# EAGLE schematic AnalogInputModule_r1_1 (EAGLE 8.4.3)
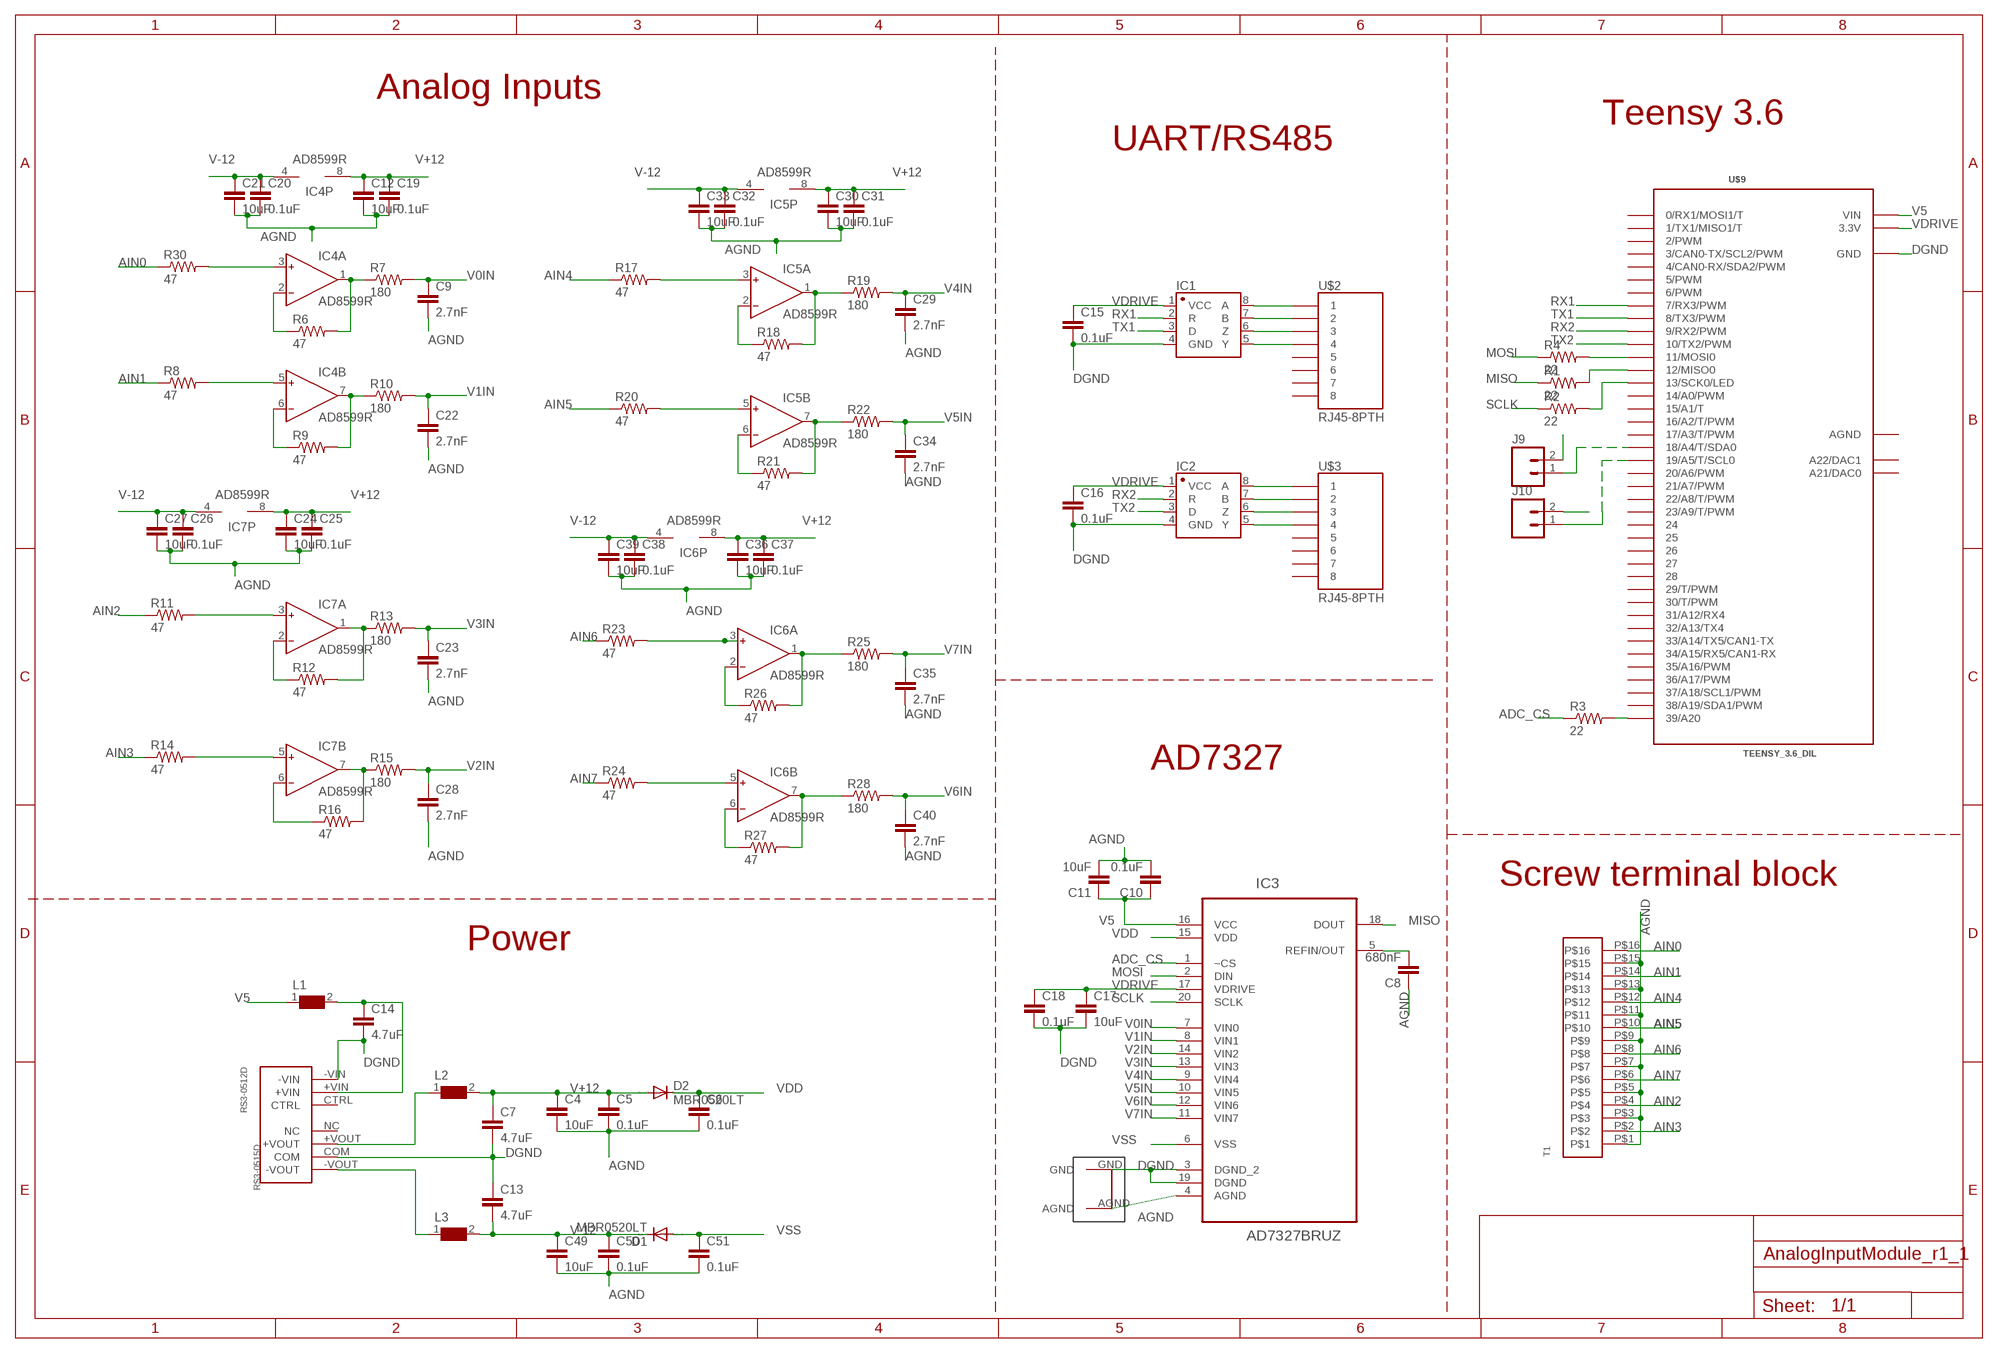
[diagram p0: schematic, sheet 1]

## Parts
C4  10uF  10UF-0805-10V-10%  [0805]
C5  0.1uF  1.0UF-0805-25V-10%  [0805]
C6  0.1uF  1.0UF-0805-25V-10%  [0805]
C7  4.7uF  4.7UF-1206-16V-(+80/-20%)  [1206]
C8  680nF  1.0UF-0805-25V-10%  [0805]
C9  2.7nF  1.0UF-0805-25V-10%  [0805]
C10  0.1uF  1.0UF-0805-25V-10%  [0805]
C11  10uF  10UF-0805-10V-10%  [0805]
C12  10uF  10UF-0805-10V-10%  [0805]
C13  4.7uF  4.7UF-1206-16V-(+80/-20%)  [1206]
C14  4.7uF  4.7UF-1206-16V-(+80/-20%)  [1206]
C15  0.1uF  1.0UF-0805-25V-10%  [0805]
C16  0.1uF  1.0UF-0805-25V-10%  [0805]
C17  10uF  10UF-0805-10V-10%  [0805]
C18  0.1uF  1.0UF-0805-25V-10%  [0805]
C19  0.1uF  1.0UF-0805-25V-10%  [0805]
C20  0.1uF  1.0UF-0805-25V-10%  [0805]
C21  10uF  10UF-0805-10V-10%  [0805]
C22  2.7nF  1.0UF-0805-25V-10%  [0805]
C23  2.7nF  1.0UF-0805-25V-10%  [0805]
C24  10uF  10UF-0805-10V-10%  [0805]
C25  0.1uF  1.0UF-0805-25V-10%  [0805]
C26  0.1uF  1.0UF-0805-25V-10%  [0805]
C27  10uF  10UF-0805-10V-10%  [0805]
C28  2.7nF  1.0UF-0805-25V-10%  [0805]
C29  2.7nF  1.0UF-0805-25V-10%  [0805]
C30  10uF  10UF-0805-10V-10%  [0805]
C31  0.1uF  1.0UF-0805-25V-10%  [0805]
C32  0.1uF  1.0UF-0805-25V-10%  [0805]
C33  10uF  10UF-0805-10V-10%  [0805]
C34  2.7nF  1.0UF-0805-25V-10%  [0805]
C35  2.7nF  1.0UF-0805-25V-10%  [0805]
C36  10uF  10UF-0805-10V-10%  [0805]
C37  0.1uF  1.0UF-0805-25V-10%  [0805]
C38  0.1uF  1.0UF-0805-25V-10%  [0805]
C39  10uF  10UF-0805-10V-10%  [0805]
C40  2.7nF  1.0UF-0805-25V-10%  [0805]
C49  10uF  10UF-0805-10V-10%  [0805]
C50  0.1uF  1.0UF-0805-25V-10%  [0805]
C51  0.1uF  1.0UF-0805-25V-10%  [0805]
D1  MBR0520LT  [SOD123]
D2  MBR0520LT  [SOD123]
IC1  SN65HVD31DR  [SO08]
IC2  SN65HVD31DR  [SO08]
IC3  AD7327BRUZ  [SOP65P640X120-20N]
IC4  AD8599R  [SO8]
IC5  AD8599R  [SO8]
IC6  AD8599R  [SO8]
IC7  AD8599R  [SO8]
J9  M023.5MM  [SCREWTERMINAL-3.5MM-2]
J10  M023.5MM  [SCREWTERMINAL-3.5MM-2]
L1  WE-CBF-742792118_1206  [1206]
L2  WE-CBF-742792118_1206  [1206]
L3  WE-CBF-742792118_1206  [1206]
R1  22  R-US_R0805  [R0805]
R2  22  R-US_R0805  [R0805]
R3  22  R-US_R0805  [R0805]
R4  22  R-US_R0805  [R0805]
R6  47  R-US_R0805  [R0805]
R7  180  R-US_R0805  [R0805]
R8  47  R-US_R0805  [R0805]
R9  47  R-US_R0805  [R0805]
R10  180  R-US_R0805  [R0805]
R11  47  R-US_R0805  [R0805]
R12  47  R-US_R0805  [R0805]
R13  180  R-US_R0805  [R0805]
R14  47  R-US_R0805  [R0805]
R15  180  R-US_R0805  [R0805]
R16  47  R-US_R0805  [R0805]
R17  47  R-US_R0805  [R0805]
R18  47  R-US_R0805  [R0805]
R19  180  R-US_R0805  [R0805]
R20  47  R-US_R0805  [R0805]
R21  47  R-US_R0805  [R0805]
R22  180  R-US_R0805  [R0805]
R23  47  R-US_R0805  [R0805]
R24  47  R-US_R0805  [R0805]
R25  180  R-US_R0805  [R0805]
R26  47  R-US_R0805  [R0805]
R27  47  R-US_R0805  [R0805]
R28  180  R-US_R0805  [R0805]
R30  47  R-US_R0805  [R0805]
RS3-0512D  RS3-0515D  [RS3-0515D]
T1  16POS_SCREWTERMINAL  [16POS_SCREWTERMINAL]
U$2  RJ45-8PTH  [RJ45-8]
U$3  RJ45-8PTH  [RJ45-8]
U$4  GNDPLANESHRT  [GNDPLANESHRT]
U$9  TEENSY_3.6_DIL  [TEENSY_3.6_DIL]

## Nets
+VOUT: L2.1 RS3-0512D.+VOUT
-VOUT: L3.1 RS3-0512D.-VOUT
ADC_CS: IC3.1(~CS) R3.1
AGND: C4.2 C5.2 C6.2 C8.1 C9.2 C10.2 C11.2 C12.2 C19.2 C20.2 C21.2 C22.2 C23.2 C24.2 C25.2 C26.2 C27.2 C28.2 C29.2 C30.2 C31.2 C32.2 C33.2 C34.2 C35.2 C36.2 C37.2 C38.2 C39.2 C40.2 C49.2 C50.2 C51.2 IC3.4(AGND) T1.P$1 T1.P$3 T1.P$5 T1.P$7 T1.P$9 T1.P$11 T1.P$13 T1.P$15 U$4.AGND
AIN0: R30.1 T1.P$16
AIN1: R8.1 T1.P$14
AIN2: R11.1 T1.P$4
AIN3: R14.1 T1.P$2
AIN4: R17.1 T1.P$12
AIN5: R20.1 T1.P$10
AIN6: R23.1 T1.P$8
AIN7: R24.1 T1.P$6
DGND: C7.2 C13.1 C14.2 C15.2 C16.2 C17.2 C18.2 IC1.4(GND) IC2.4(GND) IC3.3(DGND_2) IC3.19(DGND) J9.2 J10.2 RS3-0512D.-VIN RS3-0512D.COM U$4.GND U$9.GND U$9.GND1(GND)
MISO: IC3.18(DOUT) R1.1
MOSI: IC3.2(DIN) R4.1
N$1: IC1.6(Z) U$2.3
N$3: IC1.8(A) U$2.1
N$4: IC1.5(Y) U$2.4
N$5: IC1.7(B) U$2.2
N$6: IC2.6(Z) U$3.3
N$7: IC2.5(Y) U$3.4
N$8: IC2.8(A) U$3.1
N$9: IC2.7(B) U$3.2
N$10: R4.2 U$9.11(11/MOSI0)
N$11: R1.2 U$9.12(12/MISO0)
N$12: C14.1 L1.2 RS3-0512D.+VIN
N$13: R3.2 U$9.39/A20
N$14: IC4.3(A:IN+) R30.2
N$15: R2.2 U$9.13(13/SCK0/LED)
N$16: IC4.2(A:IN-) R6.1
N$17: IC4.1(A:OUT) R6.2 R7.1
N$18: J9.1 U$9.18/A4(18/A4/T/SDA0)
N$19: J10.1 U$9.19/A5(19/A5/T/SCL0)
N$20: IC4.5(B:IN+) R8.2
N$21: IC4.6(B:IN-) R9.1
N$22: IC4.7(B:OUT) R9.2 R10.1
N$23: IC7.3(A:IN+) R11.2
N$24: IC7.2(A:IN-) R12.1
N$25: IC7.1(A:OUT) R12.2 R13.1
N$28: IC7.5(B:IN+) R14.2
N$29: IC7.6(B:IN-) R16.1
N$30: IC7.7(B:OUT) R15.1 R16.2
N$31: IC5.3(A:IN+) R17.2
N$32: IC5.2(A:IN-) R18.1
N$33: IC5.1(A:OUT) R18.2 R19.1
N$36: IC5.5(B:IN+) R20.2
N$37: IC5.6(B:IN-) R21.1
N$38: IC5.7(B:OUT) R21.2 R22.1
N$39: IC6.3(A:IN+) R23.2
N$40: IC6.2(A:IN-) R26.1
N$41: IC6.1(A:OUT) R25.1 R26.2
N$44: IC6.5(B:IN+) R24.2
N$45: IC6.6(B:IN-) R27.1
N$46: IC6.7(B:OUT) R27.2 R28.1
REF: C8.2 IC3.5(REFIN/OUT)
RX1: IC1.2(R) U$9.7(7/RX3/PWM)
RX2: IC2.2(R) U$9.9(9/RX2/PWM)
SCLK: IC3.20(SCLK) R2.1
TX1: IC1.3(D) U$9.8(8/TX3/PWM)
TX2: IC2.3(D) U$9.10(10/TX2/PWM)
V0IN: C9.1 IC3.7(VIN0) R7.2
V1IN: C22.1 IC3.8(VIN1) R10.2
V2IN: C28.1 IC3.14(VIN2) R15.2
V3IN: C23.1 IC3.13(VIN3) R13.2
V4IN: C29.1 IC3.9(VIN4) R19.2
V5: C10.1 C11.1 IC3.16(VCC) L1.1 U$9.VIN
V5IN: C34.1 IC3.10(VIN5) R22.2
V6IN: C40.1 IC3.12(VIN6) R28.2
V7IN: C35.1 IC3.11(VIN7) R25.2
V+12: C4.1 C5.1 C7.1 C12.1 C19.1 C24.1 C25.1 C30.1 C31.1 C36.1 C37.1 D2.A IC4.8(P:V+) IC5.8(P:V+) IC6.8(P:V+) IC7.8(P:V+) L2.2
V-12: C13.2 C20.1 C21.1 C26.1 C27.1 C32.1 C33.1 C38.1 C39.1 C49.1 C50.1 D1.C IC4.4(P:V-) IC5.4(P:V-) IC6.4(P:V-) IC7.4(P:V-) L3.2
VDD: C6.1 D2.C IC3.15(VDD)
VDRIVE: C15.1 C16.1 C17.1 C18.1 IC1.1(VCC) IC2.1(VCC) IC3.17(VDRIVE) U$9.3.3V U$9.3.3V3(3.3V)
VSS: C51.1 D1.A IC3.6(VSS)
Unconnected: RS3-0512D.CTRL RS3-0512D.NC U$2.5 U$2.6 U$2.7 U$2.8 U$3.5 U$3.6 U$3.7 U$3.8 U$9.0(0/RX1/MOSI1/T) U$9.1(1/TX1/MISO1/T) U$9.2(2/PWM) U$9.3(3/CAN0-TX/SCL2/PWM) U$9.4(4/CAN0-RX/SDA2/PWM) U$9.5(5/PWM) U$9.6(6/PWM) U$9.14/A0(14/A0/PWM) U$9.15/A1(15/A1/T) U$9.16/A2(16/A2/T/PWM) U$9.17/A3(17/A3/T/PWM) U$9.20/A6(20/A6/PWM) U$9.21/A7(21/A7/PWM) U$9.22/A8(22/A8/T/PWM) U$9.23/A9(23/A9/T/PWM) U$9.24 U$9.25 U$9.26 U$9.27 U$9.28 U$9.29(29/T/PWM) U$9.30(30/T/PWM) U$9.31/A12(31/A12/RX4) U$9.32/A13(32/A13/TX4) U$9.33/A14(33/A14/TX5/CAN1-TX) U$9.34/A15(34/A15/RX5/CAN1-RX) U$9.35/A16(35/A16/PWM) U$9.36/A17(36/A17/PWM) U$9.37/A18(37/A18/SCL1/PWM) U$9.38/A19(38/A19/SDA1/PWM) U$9.A21(A21/DAC0) U$9.A22(A22/DAC1)

## Notes on the sheet
- Analog Inputs
- Teensy 3.6
- UART/RS485
- AIN5
- AIN6
- AD7327
- AIN7
- Screw terminal block
- AGND
- Power | AIN0
- AIN1
- AIN4
- AIN5 | AIN5
- AIN6
- AIN7

## Power pins joined to a net without a drawn wire
AGND: U$9.AGND

## Library data of the parts
C4 C11 C12 C17 C21 C24 C27 C30 C33 C36 C39 C49 = SparkFun-Capacitors:10UF: 10.0µF ceramic capacitors A capacitor is a passive two-terminal electrical component used to store electrical energy temporarily in an electric field.; PROD_ID: CAP-11330
C5 C6 C8-C10 C15 C16 C18-C20 C22 C23 C25 C26 C28 C29 C31 C32 C34 C35 C37 C38 C40 C50 C51 = SparkFun-Capacitors:1.0UF: 1µF ceramic capacitors A capacitor is a passive two-terminal electrical component used to store electrical energy temporarily in an electric field.; PROD_ID: CAP-08064; VALUE: 1.0uF
C7 C13 C14 = SparkFun-Capacitors:4.7UF: 4.7µF ceramic capacitors A capacitor is a passive two-terminal electrical component used to store electrical energy temporarily in an electric field.; PROD_ID: CAP-10300
D1 D2 = diode:MBR0520LT: SCHOTTKY BARRIER RECTIFIER Source: http://onsemi.com .. MBR0520LT1-D.pdf
IC1 IC2 = Joshparts4:SN65HVD31DR: A placeholder for generic narrow & wide SOIC8 foorptints - used on the DIP adapter board.
IC3 = AD7327BRUZ:AD7327BRUZ: 500 kSPS, 8-Channel, Software-Selectable, True Bipolar Input, 12-Bit Plus Sign ADC; MPN: AD7327BRUZ; OC_FARNELL: 1274245; OC_NEWARK: 19M0860; PACKAGE: TSSOP-20; SUPPLIER: Analog devices
IC4-IC7 = analog-devices:AD8599: Single and Dual, Ultralow Distortion, Ultralow Noise Op Amps Source: http://www.analog.com/static/imported-files/data_sheets/AD8597_8599.pdf; MPN: AD8599ARZ; OC_FARNELL: 1438872; OC_NEWARK: 34M5072
J9 J10 = SparkFun-Connectors:M02: Standard 2-pin 0.1" header. Use with - straight break away headers ( PRT-00116) - right angle break away headers (PRT-00553) - swiss pins (PRT-00743) - machine pins (PRT-00117) - female headers (PRT-00115) Molex polarized connector foot print use with: PRT-08233 with associated crimp pins and housings. 2.54_SCREWTERM for use with PRT-10571. 3.5mm Screw Terminal footprints for PRT-08084 5mm Screw Terminal footprints for use with PRT-08432; PROD_ID: CONN-08399
L1-L3 = WE-CBF:WE-CBF: SMD EMI Suppression Ferrite Beads WE-CBF - Excellent anti-EMI properties - Low DC-restistance - Impedances till 3000 ohms - Rated current up to 6 A -- Reliable Ni-Sn electrodes -- Perfect as data lined filter and for uncoupling of distribution voltage; MPN: 742792118; OC_FARNELL: 1800374; OC_NEWARK: 78R5648; PACKAGE: IND-1206; SUPPLIER: Wuerth Elektronik
R1-R4 R6-R28 R30 = adafruit:R-US_: RESISTOR, American symbol
RS3-0512D = JoshParts10:RS3-0515D
T1 = JoshParts10:16POS_SCREWTERMINAL
U$2 U$3 = SparkFun:RJ45-8: RJ45 Jack Simple RJ45, 8-pin connection - connector for common Cat5, Cat5e, and Cat6 Ethernet cables. Footprint not yet proven in production. Connector sku is PRT-00643; Breakout PCB sku is BOB-00716.
U$4 = Joshparts2:GNDPLANESHRT
U$9 = Teensy_3_and_LC_Series_Boards_v1.4:TEENSY_3.6_DIL: Teensy 3.6 DIL Package